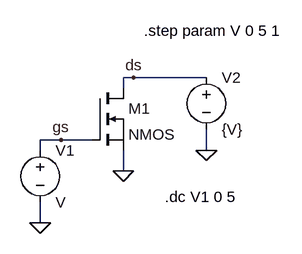
[diagram p0: schematic 20250717 NMOS FET testing.asc]
20250717 NMOS FET testing.asc, the LTspice schematic file:
Version 4
SHEET 1 880 680
WIRE 240 80 224 80
WIRE 352 80 240 80
WIRE 224 96 224 80
WIRE 128 176 96 176
WIRE 176 176 128 176
WIRE 96 192 96 176
WIRE 352 192 352 160
WIRE 224 224 224 192
WIRE 96 304 96 272
FLAG 224 224 0
FLAG 352 192 0
FLAG 96 304 0
FLAG 240 80 ds
FLAG 128 176 gs
SYMBOL nmos 176 96 R0
SYMATTR InstName M1
SYMBOL voltage 96 176 R0
SYMATTR InstName V1
SYMBOL voltage 352 64 R0
WINDOW 123 0 0 Left 0
WINDOW 39 0 0 Left 0
SYMATTR InstName V2
SYMATTR Value {V}
TEXT 256 8 Left 2 !.step param V 0 5 1
TEXT 288 264 Left 2 !.dc V1 0 5

The netlist it stands for:
* 20250717 NMOS FET testing.asc
M1 ds gs 0 0 NMOS
V1 gs 0 V
V2 ds 0 {V}
.model NMOS NMOS
.model PMOS PMOS
.lib standard.mos
.step param V 0 5 1
.dc V1 0 5
.backanno
.end